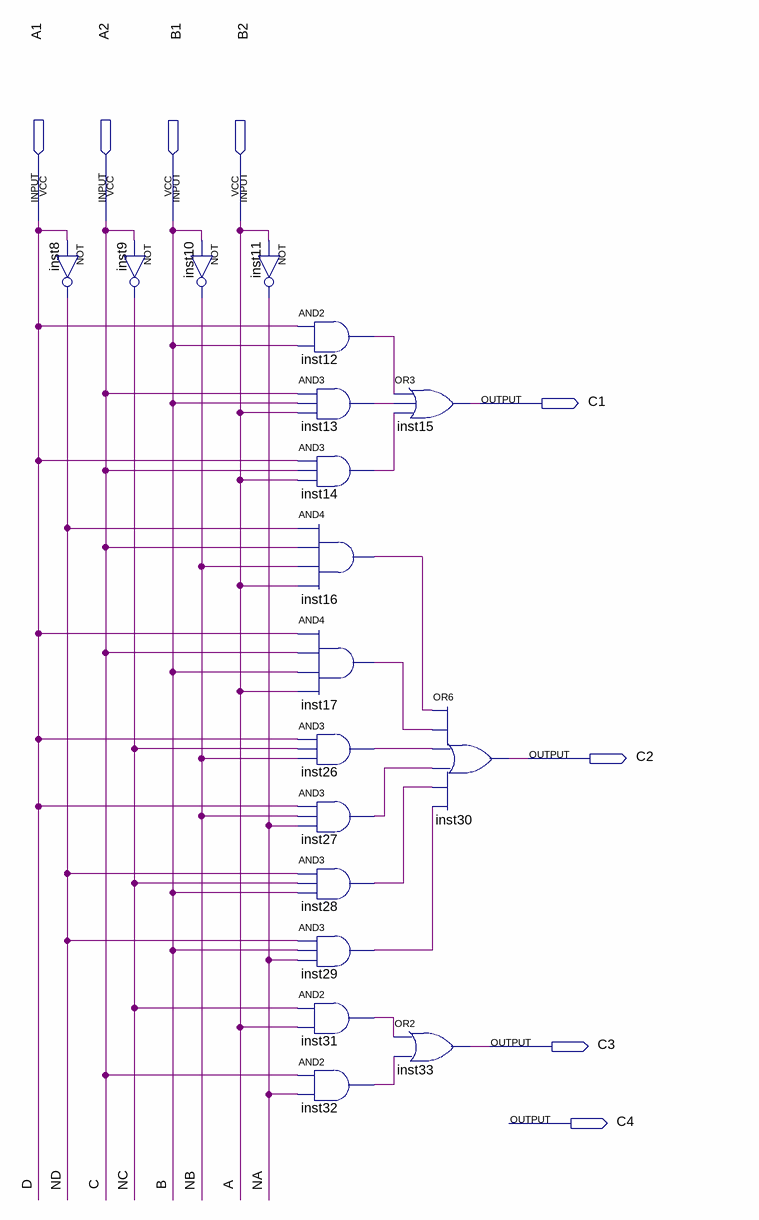
[diagram p0: schematic sheet]
// Quartus schematic TetralAdder.bdf as structural Verilog: 18 symbols, 8 pins
module TetralAdder (
  input  A1,
  input  A2,
  input  B1,
  input  B2,
  output C1,
  output C2,
  output C3,
  output C4
);

  wire inst12_out, inst13_out, inst14_out, inst16_out, inst17_out, inst26_out, inst27_out, inst28_out,
       inst29_out, inst31_out, inst32_out, NA, NB, NC, ND;

  not inst8 (ND, A1);
  not inst9 (NC, A2);
  not inst10 (NB, B1);
  not inst11 (NA, B2);
  and inst12 (inst12_out, A1, B1);
  and inst13 (inst13_out, A2, B1, B2);
  and inst14 (inst14_out, A1, A2, B2);
  and inst16 (inst16_out, ND, A2, NB, B2);
  and inst17 (inst17_out, A1, A2, B1, B2);
  and inst26 (inst26_out, A1, NC, NB);
  and inst27 (inst27_out, A1, NB, NA);
  and inst28 (inst28_out, ND, NC, B1);
  and inst29 (inst29_out, ND, B1, NA);
  and inst31 (inst31_out, NC, B2);
  and inst32 (inst32_out, A2, NA);
  or inst15 (C1, inst12_out, inst13_out, inst14_out);
  or inst30 (C2, inst16_out, inst17_out, inst26_out, inst27_out, inst28_out, inst29_out);
  or inst33 (C3, inst31_out, inst32_out);

  // Other names for the same wires on the sheet: D = A1; C = A2; B = B1; A = B2
endmodule
